# EAGLE design shield_SIM800L_2 (EAGLE 7.5.0)
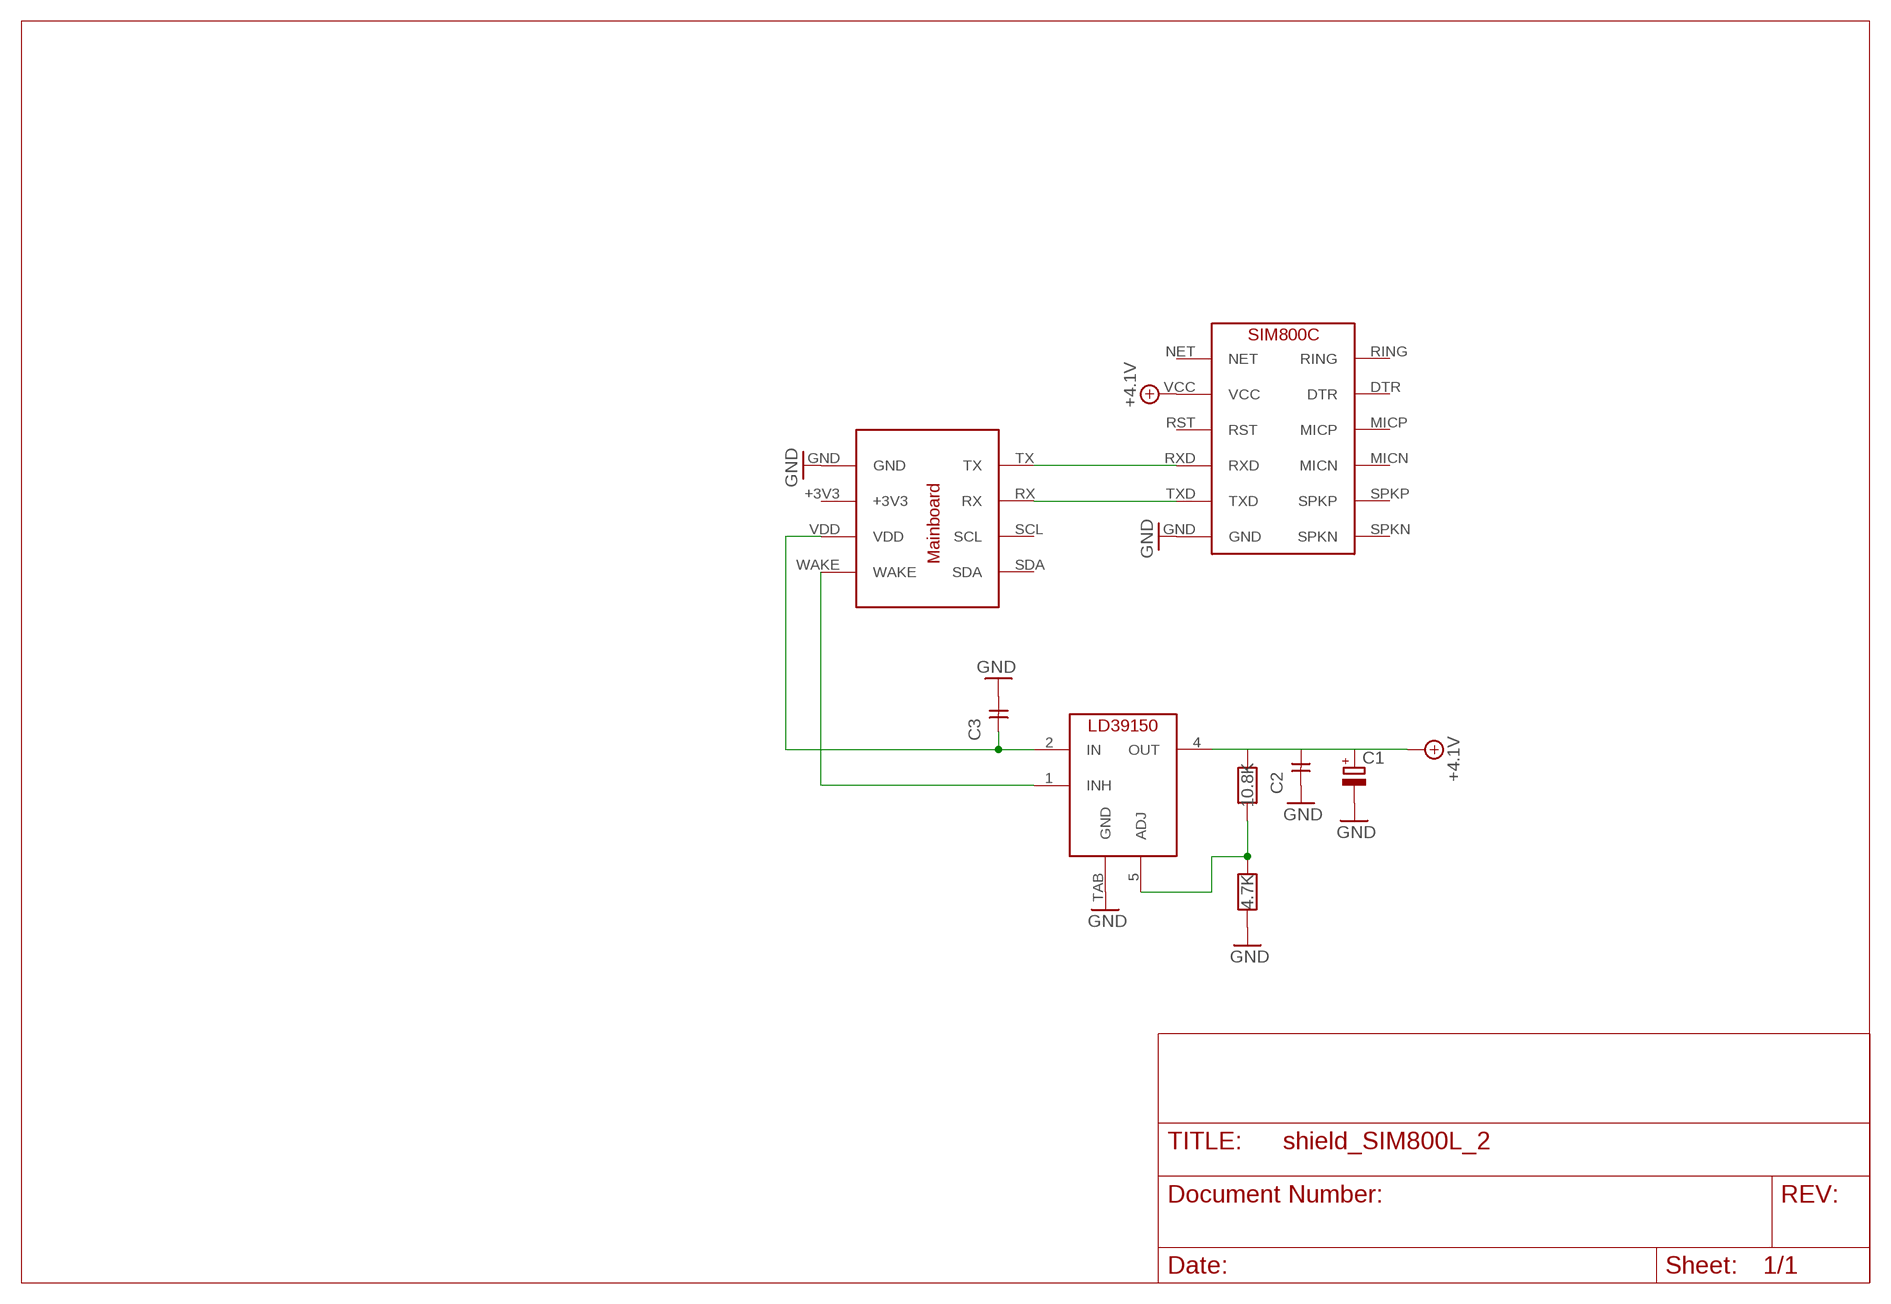
[diagram p0: schematic, sheet 1]

## Parts
C1  CPOL-EUE5-13  [E5-13]
C2  CSMD_1206  [SMD_RC_1206]
C3  CSMD_1206  [SMD_RC_1206]
R1  10.8K  RSMD_1206  [SMD_RC_1206]
R2  4.7K  RSMD_1206  [SMD_RC_1206]
U$1  SHIELD  [SHIELD]
U$2  LD39150PT-R  [PPAK]
U$6  SIM800L  [SIM800L]

## Nets
+4.1V: C1.+ C2.P$2 R1.P$1 U$2.4(OUT) U$6.VCC
GND: C1.- C2.P$1 C3.P$2 R2.P$2 U$1.GND U$2.TAB(GND) U$6.GND
N$1: U$1.RX U$6.TXD
N$2: U$1.TX U$6.RXD
N$3: R1.P$2 R2.P$1 U$2.5(ADJ)
N$4: C3.P$1 U$1.VDD U$2.2(IN)
N$6: U$1.WAKE U$2.1(INH)
Unconnected: U$1.SCL U$1.SDA U$6.DTR U$6.MICN U$6.MICP U$6.NET U$6.RING U$6.RST U$6.SPKN U$6.SPKP

## Power pins joined to a net without a drawn wire
+3V3: U$1.+3V3

## Library data of the parts
C1 = rcl:CPOL-EU: POLARIZED CAPACITOR, European symbol
C2 C3 = balance:C
R1 R2 = balance:R
U$1 = balance:SHIELD
U$2 = balance:LD39150PT-R
U$6 = balance:SIM800L

## Net classes
0 default: clearance 0.205 mm

## Board
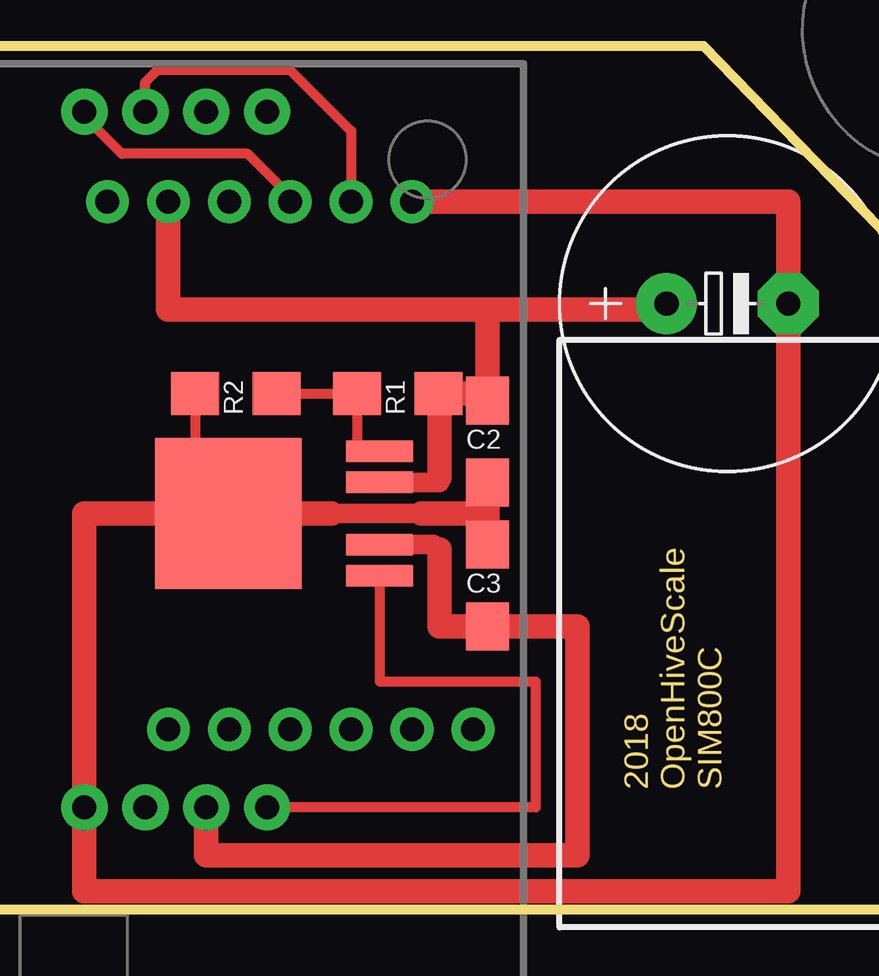
[diagram p1: board, top side]
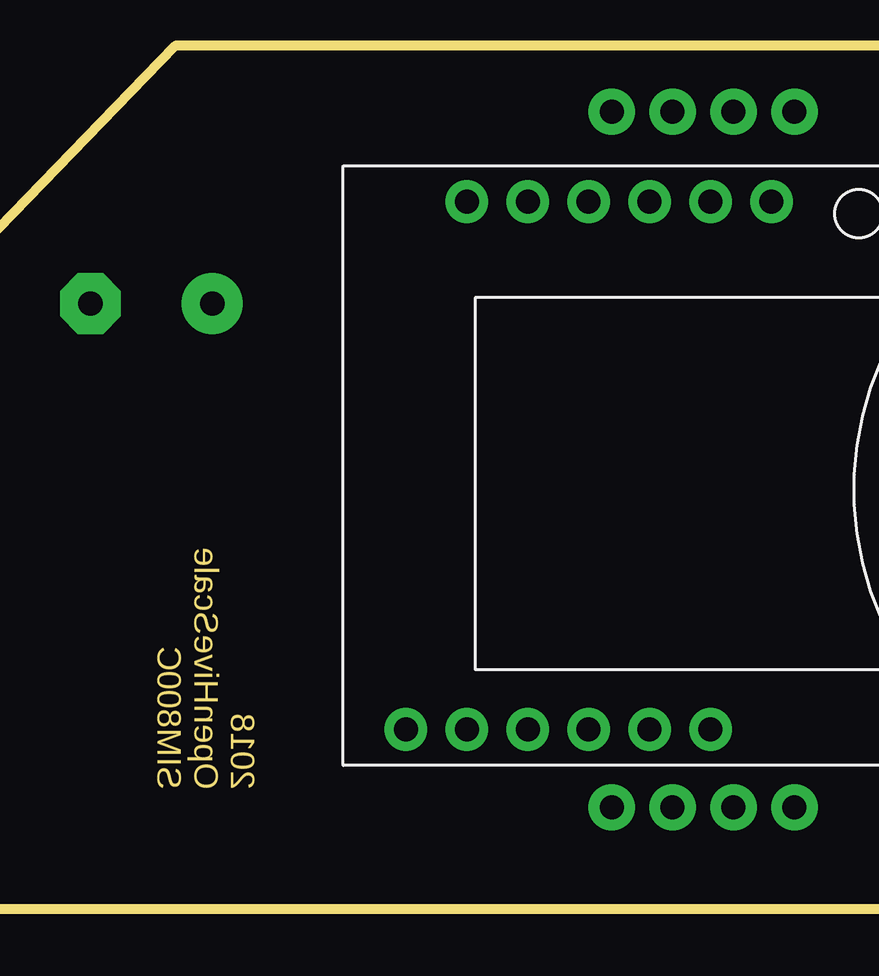
[diagram p2: board, bottom side, seen from below]

No outline drawn. Coordinates in mm, seen from the top.
Copper layers (1*16): Top 0.035mm / dielectric 1.5mm / Bottom 0.035mm
Design rules "SeeedStudio_2layer_DRU_no_angle_20140221": minimum track width 6mil, minimum drill 12mil, track to track 6mil, track to pad 6mil, pad to pad 6mil, via to via 6mil, smd to smd 0mil, copper to edge 10mil, drill to drill 10mil, minimum pad ring 10mil, minimum via ring 6mil, stop-mask expansion 2mil, vias tented up to drill 100mil, thermal gap 10mil
Milling: 5 lines

### Footprints (pad centres in the part's own frame; a part is rotated, then mirrored left to right if it is on the bottom)
E5-13 = drill 1.016 pad 2.54: + -2.54,0 | drill 1.016 pad 2.54 octagon: - 2.54,0
SMD_RC_1206 = smd 2 x 1.8: P$1 -1.7,0; P$2 1.7,0
SHIELD = drill 1 pad 1.93: +3V3 36.73,23; GND 34.19,23; RX 36.73,52; SCL 39.27,52; SDA 41.81,52; TX 34.19,52; VDD 39.27,23; WAKE 41.81,23
PPAK = smd 0.9 x 2.8: 1 -2.6,-4; 2 -1.3,-4; 4 1.3,-4; 5 2.6,-4 | smd 6.3 x 6.1: TAB 0,2.3
SIM800L = drill 1 pad 1.778: DTR 11,1.27; GND -11,-6.35; MICN 11,-3.81; MICP 11,-1.27; NET -11,6.35; RING 11,3.81; RST -11,1.27; RXD -11,-1.27; SPKN 11,-8.89; SPKP 11,-6.35; TXD -11,-3.81; VCC -11,3.81

### Placement (x,y rotation side)
C1  31,25.25 0 top
C2  21,19.5 90 top
C3  21,13.5 90 top
R1  17.25,21.5 180 top
R2  10.5,21.5 180 top
U$1  -30,-18.75 0 top
U$2  12.5,16.5 90 top
U$6  11.5,18.5 270 bottom

### Tracks (layer width: path | path; a pad name or v marks a point on that pad's centre or on a via)
+4.1V
  Top 0.813: 19,18 19,17.8 U$2.4
  Top 1.016: 19,18 19,21.25 18.95,21.25 R1.P$1 21,21.5 C2.P$2 21,25 | U$6.VCC 7.69,25 21,25 | 21,25 28.46,25 C1.+
GND
  Top 0.406: R2.P$2 8.8,16.75 | 8.8,16.5 9.25,16.5 U$2.TAB
  Top 0.813: 14.5,16.5 18.25,16.5
  Top 1.016: U$2.TAB 14.5,16.5 | 18.25,16.5 21,16.5 | C3.P$2 21,16.5 | 8.8,17.21 8.8,16.75 8.8,16.5 | C2.P$1 21,16.5 | 9.25,16.5 4.19,16.5 U$1.GND 4.19,0.75 33.54,0.75 C1.- 33.54,29.5 U$6.GND
N$1
  Top 0.406: U$1.RX 6.73,34.48 7.25,35 12.75,35 15.31,32.44 U$6.TXD
N$2
  Top 0.406: U$1.TX 4.19,33.06 5.75,31.5 11,31.5 12.77,29.73 U$6.RXD
N$3
  Top 0.406: R2.P$1 R1.P$2 15.55,19.1 U$2.5
N$4
  Top 0.813: 19,15 18.75,15.2 U$2.2
  Top 1.016: U$1.VDD 9.27,2.25 24.75,2.25 24.75,11.8 C3.P$1 19,11.8 19,15
N$6
  Top 0.406: U$2.1 16.5,9.5 23,9.5 23,4.25 U$1.WAKE

### Text on the board
Milling: 2018 / OpenHiveScale / SIM800C